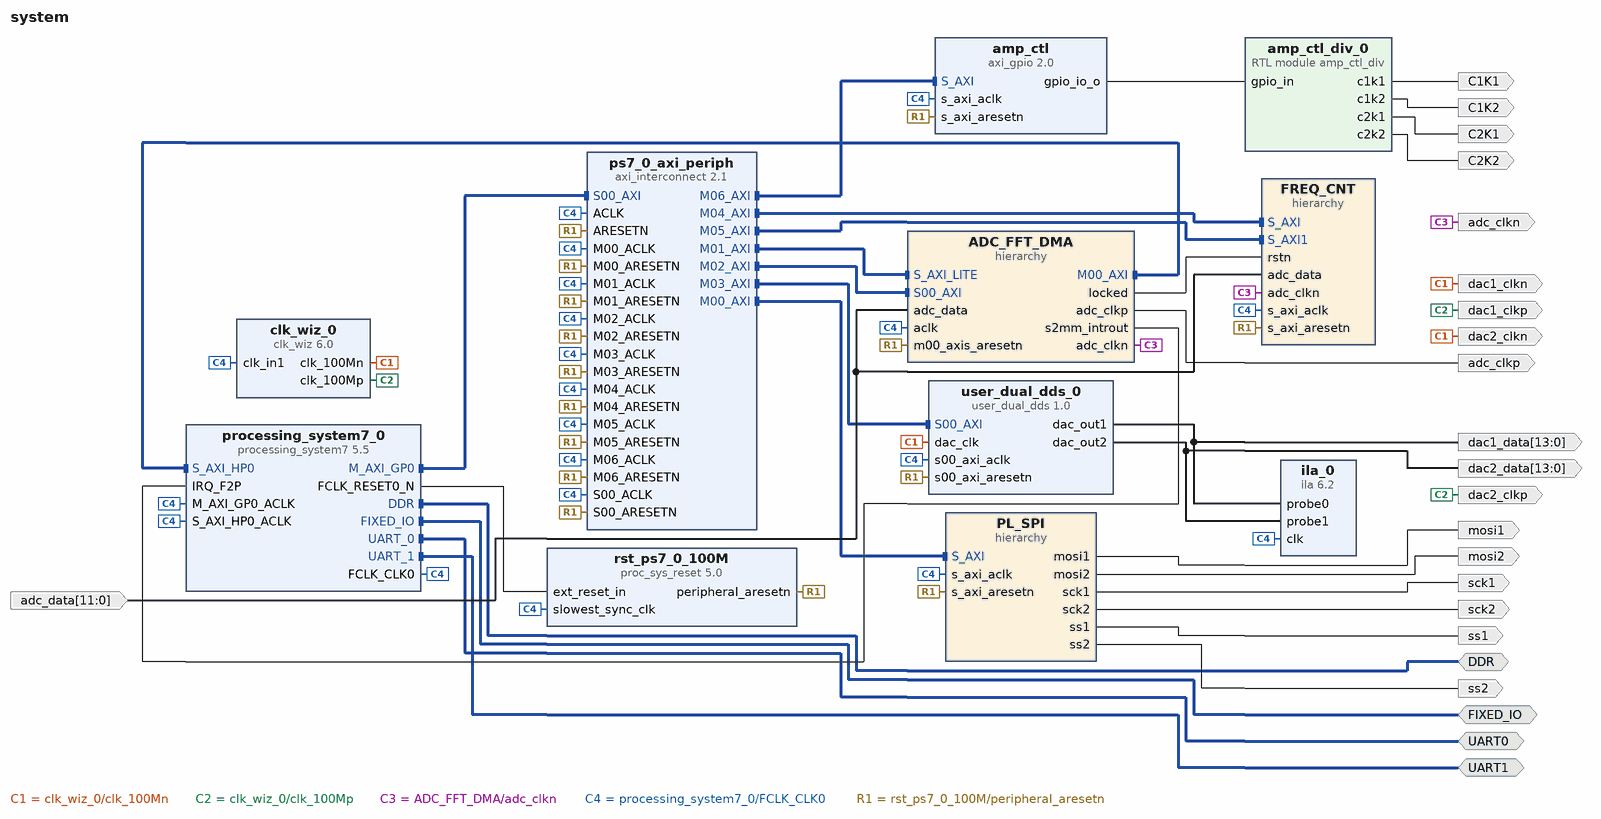
[diagram p0: block diagram of the top level]
# Vivado block design system, xc7z020clg400-2, Vivado 2023.2
create_bd_design system

create_bd_intf_port -mode Master -vlnv xilinx.com:interface:uart_rtl:1.0 UART0
create_bd_intf_port -mode Master -vlnv xilinx.com:interface:uart_rtl:1.0 UART1
create_bd_intf_port -mode Master -vlnv xilinx.com:interface:ddrx_rtl:1.0 DDR
create_bd_intf_port -mode Master -vlnv xilinx.com:display_processing_system7:fixedio_rtl:1.0 FIXED_IO
create_bd_port -dir O sck1
create_bd_port -dir O sck2
create_bd_port -dir O mosi1
create_bd_port -dir O mosi2
create_bd_port -dir O ss1
create_bd_port -dir O ss2
create_bd_port -dir O -type clk adc_clkp
create_bd_port -dir O -type clk adc_clkn
create_bd_port -dir I -from 11 -to 0 adc_data
create_bd_port -dir O -from 13 -to 0 dac1_data
create_bd_port -dir O -from 13 -to 0 dac2_data
create_bd_port -dir O -type clk dac1_clkp
create_bd_port -dir O -type clk dac1_clkn
create_bd_port -dir O -type clk dac2_clkp
create_bd_port -dir O -type clk dac2_clkn
create_bd_port -dir O C1K1
create_bd_port -dir O C1K2
create_bd_port -dir O C2K1
create_bd_port -dir O C2K2

create_bd_cell -type ip -vlnv xilinx.com:ip:processing_system7:5.5 processing_system7_0
set_property -dict [list \
  CONFIG.PCW_APU_PERIPHERAL_FREQMHZ 666.666666 \
  CONFIG.PCW_CPU_CPU_6X4X_MAX_RANGE 767 \
  CONFIG.PCW_ENET0_PERIPHERAL_ENABLE 0 \
  CONFIG.PCW_FCLK_CLK0_BUF FALSE \
  CONFIG.PCW_FPGA0_PERIPHERAL_FREQMHZ 100 \
  CONFIG.PCW_FPGA1_PERIPHERAL_FREQMHZ 50 \
  CONFIG.PCW_GPIO_MIO_GPIO_ENABLE 0 \
  CONFIG.PCW_IRQ_F2P_INTR 1 \
  CONFIG.PCW_PERIPHERAL_BOARD_PRESET None \
  CONFIG.PCW_PRESET_BANK1_VOLTAGE {LVCMOS 1.8V} \
  CONFIG.PCW_QSPI_GRP_FBCLK_ENABLE 1 \
  CONFIG.PCW_QSPI_GRP_FBCLK_IO {MIO 8} \
  CONFIG.PCW_QSPI_GRP_SINGLE_SS_ENABLE 1 \
  CONFIG.PCW_QSPI_GRP_SINGLE_SS_IO {MIO 1 .. 6} \
  CONFIG.PCW_QSPI_PERIPHERAL_ENABLE 1 \
  CONFIG.PCW_QSPI_PERIPHERAL_FREQMHZ 125 \
  CONFIG.PCW_QSPI_QSPI_IO {MIO 1 .. 6} \
  CONFIG.PCW_SD0_GRP_CD_ENABLE 1 \
  CONFIG.PCW_SD0_GRP_CD_IO {MIO 47} \
  CONFIG.PCW_SD0_GRP_WP_ENABLE 0 \
  CONFIG.PCW_SD0_PERIPHERAL_ENABLE 1 \
  CONFIG.PCW_SD0_SD0_IO {MIO 40 .. 45} \
  CONFIG.PCW_SD1_GRP_CD_ENABLE 1 \
  CONFIG.PCW_SD1_GRP_CD_IO {MIO 9} \
  CONFIG.PCW_SD1_GRP_WP_ENABLE 1 \
  CONFIG.PCW_SD1_GRP_WP_IO {MIO 0} \
  CONFIG.PCW_SD1_PERIPHERAL_ENABLE 1 \
  CONFIG.PCW_SD1_SD1_IO {MIO 10 .. 15} \
  CONFIG.PCW_SDIO_PERIPHERAL_FREQMHZ 100 \
  CONFIG.PCW_SINGLE_QSPI_DATA_MODE x4 \
  CONFIG.PCW_UART0_PERIPHERAL_ENABLE 1 \
  CONFIG.PCW_UART0_UART0_IO EMIO \
  CONFIG.PCW_UART1_PERIPHERAL_ENABLE 1 \
  CONFIG.PCW_UART1_UART1_IO EMIO \
  CONFIG.PCW_UART_PERIPHERAL_FREQMHZ 100 \
  CONFIG.PCW_UIPARAM_DDR_FREQ_MHZ 533.333333 \
  CONFIG.PCW_UIPARAM_DDR_PARTNO {MT41K256M16 RE-125} \
  CONFIG.PCW_USB0_PERIPHERAL_ENABLE 0 \
  CONFIG.PCW_USE_FABRIC_INTERRUPT 1 \
  CONFIG.PCW_USE_S_AXI_HP0 1 \
] [get_bd_cells processing_system7_0]
# 412 more settings of processing_system7_0 are not shown: defaults, MIO pin electricals, DDR timing, and values the tool derives
create_bd_cell -type ip -vlnv xilinx.com:ip:axi_interconnect:2.1 ps7_0_axi_periph
set_property -dict {CONFIG.NUM_MI 7} [get_bd_cells ps7_0_axi_periph]
create_bd_cell -type ip -vlnv xilinx.com:ip:proc_sys_reset:5.0 rst_ps7_0_100M
create_bd_cell -type hier ADC_FFT_DMA
create_bd_cell -type ip -vlnv xilinx.com:ip:clk_wiz:6.0 clk_wiz_0
set_property -dict [list \
  CONFIG.CLKOUT2_JITTER 130.958 \
  CONFIG.CLKOUT2_PHASE_ERROR 98.575 \
  CONFIG.CLKOUT2_REQUESTED_PHASE 180 \
  CONFIG.CLKOUT2_USED true \
  CONFIG.CLK_OUT1_PORT clk_100Mp \
  CONFIG.CLK_OUT2_PORT clk_100Mn \
  CONFIG.MMCM_CLKOUT1_DIVIDE 10 \
  CONFIG.MMCM_CLKOUT1_PHASE 180.000 \
  CONFIG.NUM_OUT_CLKS 2 \
  CONFIG.PRIM_IN_FREQ 100.000 \
  CONFIG.USE_LOCKED false \
  CONFIG.USE_RESET false \
] [get_bd_cells clk_wiz_0]
create_bd_cell -type hier PL_SPI
create_bd_cell -type ip -vlnv xilinx.com:user:user_dual_dds:1.0 user_dual_dds_0
create_bd_cell -type ip -vlnv xilinx.com:ip:ila:6.2 ila_0
set_property -dict [list \
  CONFIG.ALL_PROBE_SAME_MU false \
  CONFIG.C_DATA_DEPTH 4096 \
  CONFIG.C_EN_STRG_QUAL 1 \
  CONFIG.C_MONITOR_TYPE Native \
  CONFIG.C_NUM_OF_PROBES 2 \
  CONFIG.C_PROBE0_WIDTH 14 \
  CONFIG.C_PROBE1_WIDTH 14 \
] [get_bd_cells ila_0]
create_bd_cell -type hier FREQ_CNT
create_bd_cell -type module -reference amp_ctl_div amp_ctl_div_0
create_bd_cell -type ip -vlnv xilinx.com:ip:axi_gpio:2.0 amp_ctl
set_property -dict {CONFIG.C_ALL_OUTPUTS 1 CONFIG.C_GPIO_WIDTH 4} [get_bd_cells amp_ctl]

# ---- hierarchy /ADC_FFT_DMA ----
current_bd_instance /ADC_FFT_DMA
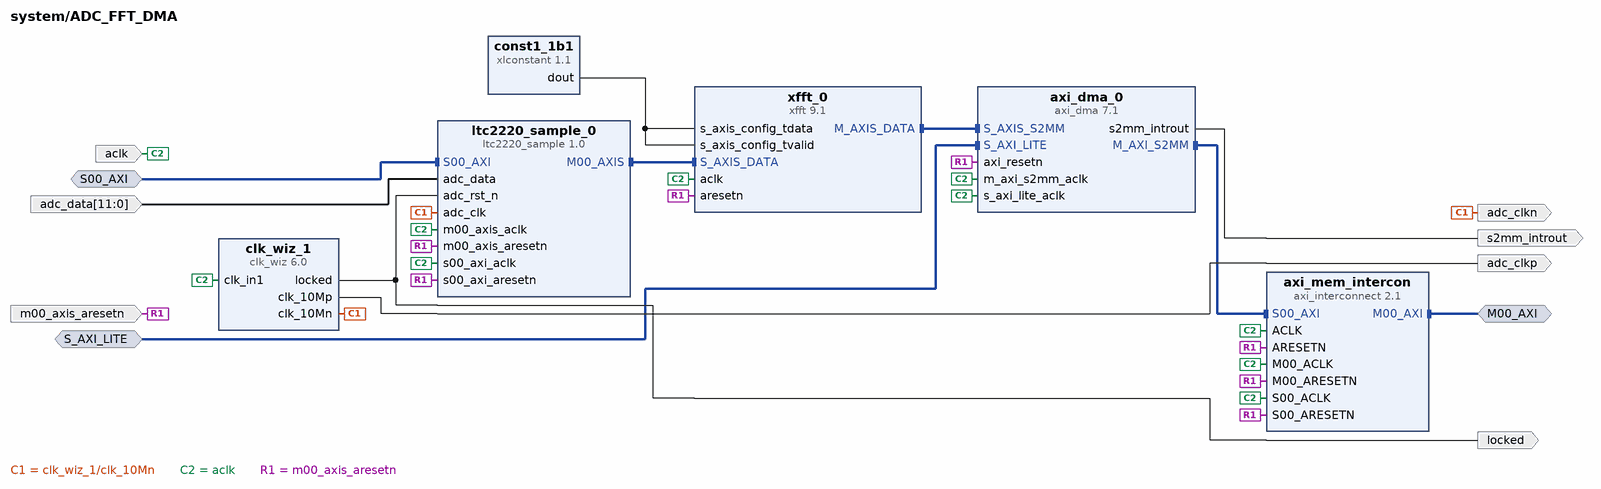
[diagram p1: block diagram inside /ADC_FFT_DMA]
create_bd_intf_pin -mode Slave -vlnv xilinx.com:interface:aximm_rtl:1.0 S_AXI_LITE
create_bd_intf_pin -mode Slave -vlnv xilinx.com:interface:aximm_rtl:1.0 S00_AXI
create_bd_intf_pin -mode Master -vlnv xilinx.com:interface:aximm_rtl:1.0 M00_AXI
create_bd_pin -dir I -type clk aclk
create_bd_pin -dir I -type rst m00_axis_aresetn
create_bd_pin -dir O -type intr s2mm_introut
create_bd_pin -dir I -from 11 -to 0 adc_data
create_bd_pin -dir O -type clk adc_clkp
create_bd_pin -dir O -type clk adc_clkn
create_bd_pin -dir O locked

create_bd_cell -type ip -vlnv xilinx.com:ip:xlconstant:1.1 const1_1b1
create_bd_cell -type ip -vlnv xilinx.com:ip:axi_dma:7.1 axi_dma_0
set_property -dict [list \
  CONFIG.c_include_mm2s 0 \
  CONFIG.c_include_sg 0 \
  CONFIG.c_m_axi_s2mm_data_width 64 \
  CONFIG.c_s_axis_s2mm_tdata_width 64 \
  CONFIG.c_sg_length_width 18 \
] [get_bd_cells axi_dma_0]
create_bd_cell -type ip -vlnv xilinx.com:ip:xfft:9.1 xfft_0
set_property -dict [list \
  CONFIG.aresetn true \
  CONFIG.data_format fixed_point \
  CONFIG.implementation_options radix_2_burst_io \
  CONFIG.input_width 16 \
  CONFIG.number_of_stages_using_block_ram_for_data_and_phase_factors 0 \
  CONFIG.output_ordering natural_order \
  CONFIG.scaling_options unscaled \
  CONFIG.target_clock_frequency 100 \
  CONFIG.transform_length 8192 \
] [get_bd_cells xfft_0]
create_bd_cell -type ip -vlnv xilinx.com:user:ltc2220_sample:1.0 ltc2220_sample_0
create_bd_cell -type ip -vlnv xilinx.com:ip:axi_interconnect:2.1 axi_mem_intercon
set_property -dict {CONFIG.NUM_MI 1} [get_bd_cells axi_mem_intercon]
create_bd_cell -type ip -vlnv xilinx.com:ip:clk_wiz:6.0 clk_wiz_1
set_property -dict [list \
  CONFIG.CLKOUT1_JITTER 209.588 \
  CONFIG.CLKOUT1_REQUESTED_OUT_FREQ 10 \
  CONFIG.CLKOUT2_JITTER 209.588 \
  CONFIG.CLKOUT2_PHASE_ERROR 98.575 \
  CONFIG.CLKOUT2_USED true \
  CONFIG.CLK_OUT1_PORT clk_10Mp \
  CONFIG.MMCM_CLKOUT0_DIVIDE_F 100.000 \
  CONFIG.MMCM_CLKOUT1_DIVIDE 100 \
  CONFIG.NUM_OUT_CLKS 2 \
  CONFIG.USE_RESET false \
] [get_bd_cells clk_wiz_1]

# ---- hierarchy /PL_SPI ----
current_bd_instance /PL_SPI
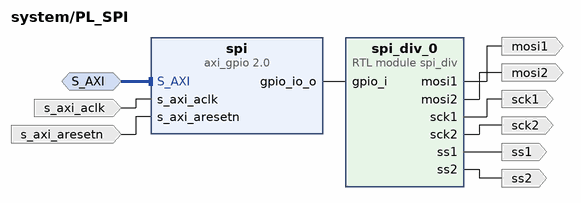
[diagram p2: block diagram inside /PL_SPI]
create_bd_intf_pin -mode Slave -vlnv xilinx.com:interface:aximm_rtl:1.0 S_AXI
create_bd_pin -dir O sck1
create_bd_pin -dir O sck2
create_bd_pin -dir O mosi1
create_bd_pin -dir O mosi2
create_bd_pin -dir O ss1
create_bd_pin -dir O ss2
create_bd_pin -dir I -type clk s_axi_aclk
create_bd_pin -dir I -type rst s_axi_aresetn

create_bd_cell -type module -reference spi_div spi_div_0
create_bd_cell -type ip -vlnv xilinx.com:ip:axi_gpio:2.0 spi
set_property -dict {CONFIG.C_ALL_OUTPUTS 1 CONFIG.C_GPIO_WIDTH 4} [get_bd_cells spi]

# ---- hierarchy /FREQ_CNT ----
current_bd_instance /FREQ_CNT
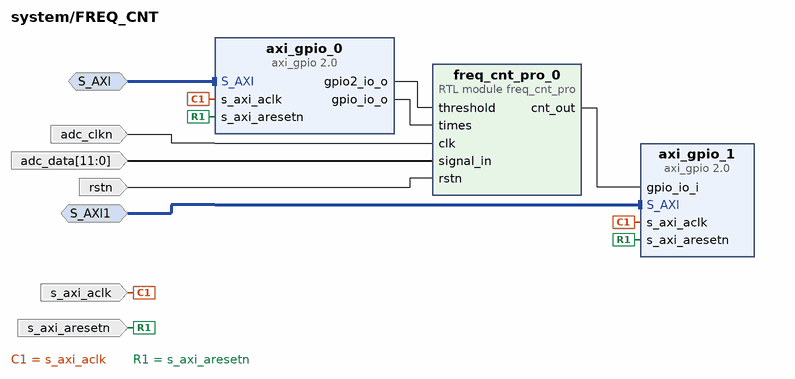
[diagram p3: block diagram inside /FREQ_CNT]
create_bd_intf_pin -mode Slave -vlnv xilinx.com:interface:aximm_rtl:1.0 S_AXI
create_bd_intf_pin -mode Slave -vlnv xilinx.com:interface:aximm_rtl:1.0 S_AXI1
create_bd_pin -dir I -type clk adc_clkn
create_bd_pin -dir I -type rst rstn
create_bd_pin -dir I -from 11 -to 0 adc_data
create_bd_pin -dir I -type clk s_axi_aclk
create_bd_pin -dir I -type rst s_axi_aresetn

create_bd_cell -type ip -vlnv xilinx.com:ip:axi_gpio:2.0 axi_gpio_0
set_property -dict [list \
  CONFIG.C_ALL_INPUTS 0 \
  CONFIG.C_ALL_INPUTS_2 0 \
  CONFIG.C_ALL_OUTPUTS 1 \
  CONFIG.C_ALL_OUTPUTS_2 1 \
  CONFIG.C_GPIO2_WIDTH 12 \
  CONFIG.C_IS_DUAL 1 \
] [get_bd_cells axi_gpio_0]
create_bd_cell -type module -reference freq_cnt_pro freq_cnt_pro_0
set_property -dict {CONFIG.WD 12} [get_bd_cells freq_cnt_pro_0]
create_bd_cell -type ip -vlnv xilinx.com:ip:axi_gpio:2.0 axi_gpio_1
set_property -dict {CONFIG.C_ALL_INPUTS 1 CONFIG.C_IS_DUAL 0} [get_bd_cells axi_gpio_1]

# ---- connections ----

current_bd_instance /ADC_FFT_DMA
connect_bd_intf_net [get_bd_intf_pins axi_dma_0/M_AXI_S2MM] [get_bd_intf_pins axi_mem_intercon/S00_AXI]
connect_bd_intf_net [get_bd_intf_pins M00_AXI] [get_bd_intf_pins axi_mem_intercon/M00_AXI]
connect_bd_intf_net [get_bd_intf_pins ltc2220_sample_0/M00_AXIS] [get_bd_intf_pins xfft_0/S_AXIS_DATA]
connect_bd_intf_net [get_bd_intf_pins S_AXI_LITE] [get_bd_intf_pins axi_dma_0/S_AXI_LITE]
connect_bd_intf_net [get_bd_intf_pins S00_AXI] [get_bd_intf_pins ltc2220_sample_0/S00_AXI]
connect_bd_intf_net [get_bd_intf_pins xfft_0/M_AXIS_DATA] [get_bd_intf_pins axi_dma_0/S_AXIS_S2MM]
connect_bd_net [get_bd_pins adc_data] [get_bd_pins ltc2220_sample_0/adc_data]
connect_bd_net [get_bd_pins axi_dma_0/s2mm_introut] [get_bd_pins s2mm_introut]
connect_bd_net [get_bd_pins clk_wiz_1/clk_10Mn] [get_bd_pins adc_clkn] [get_bd_pins ltc2220_sample_0/adc_clk]
connect_bd_net [get_bd_pins clk_wiz_1/clk_10Mp] [get_bd_pins adc_clkp]
connect_bd_net [get_bd_pins clk_wiz_1/locked] [get_bd_pins locked] [get_bd_pins ltc2220_sample_0/adc_rst_n]
connect_bd_net -net const_1b1_dout [get_bd_pins const1_1b1/dout] [get_bd_pins xfft_0/s_axis_config_tdata] [get_bd_pins xfft_0/s_axis_config_tvalid]
connect_bd_net -net processing_system7_0_FCLK_CLK0 [get_bd_pins aclk] \
  [get_bd_pins xfft_0/aclk] [get_bd_pins axi_dma_0/m_axi_s2mm_aclk] [get_bd_pins axi_mem_intercon/S00_ACLK] \
  [get_bd_pins axi_mem_intercon/M00_ACLK] [get_bd_pins axi_mem_intercon/ACLK] [get_bd_pins axi_dma_0/s_axi_lite_aclk] \
  [get_bd_pins clk_wiz_1/clk_in1] [get_bd_pins ltc2220_sample_0/m00_axis_aclk] [get_bd_pins ltc2220_sample_0/s00_axi_aclk]
connect_bd_net -net rst_ps7_0_100M_peripheral_aresetn [get_bd_pins m00_axis_aresetn] \
  [get_bd_pins axi_mem_intercon/S00_ARESETN] [get_bd_pins axi_mem_intercon/M00_ARESETN] \
  [get_bd_pins axi_mem_intercon/ARESETN] [get_bd_pins axi_dma_0/axi_resetn] [get_bd_pins xfft_0/aresetn] \
  [get_bd_pins ltc2220_sample_0/m00_axis_aresetn] [get_bd_pins ltc2220_sample_0/s00_axi_aresetn]

current_bd_instance /PL_SPI
connect_bd_intf_net [get_bd_intf_pins S_AXI] [get_bd_intf_pins spi/S_AXI]
connect_bd_net -net processing_system7_0_FCLK_CLK0 [get_bd_pins s_axi_aclk] [get_bd_pins spi/s_axi_aclk]
connect_bd_net -net rst_ps7_0_100M_peripheral_aresetn [get_bd_pins s_axi_aresetn] [get_bd_pins spi/s_axi_aresetn]
connect_bd_net [get_bd_pins spi_div_0/mosi1] [get_bd_pins mosi1]
connect_bd_net [get_bd_pins spi_div_0/mosi2] [get_bd_pins mosi2]
connect_bd_net [get_bd_pins spi_div_0/sck1] [get_bd_pins sck1]
connect_bd_net [get_bd_pins spi_div_0/sck2] [get_bd_pins sck2]
connect_bd_net [get_bd_pins spi_div_0/ss1] [get_bd_pins ss1]
connect_bd_net [get_bd_pins spi_div_0/ss2] [get_bd_pins ss2]
connect_bd_net [get_bd_pins spi/gpio_io_o] [get_bd_pins spi_div_0/gpio_i]

current_bd_instance /FREQ_CNT
connect_bd_intf_net [get_bd_intf_pins axi_gpio_1/S_AXI] [get_bd_intf_pins S_AXI1]
connect_bd_intf_net [get_bd_intf_pins S_AXI] [get_bd_intf_pins axi_gpio_0/S_AXI]
connect_bd_net [get_bd_pins adc_clkn] [get_bd_pins freq_cnt_pro_0/clk]
connect_bd_net [get_bd_pins adc_data] [get_bd_pins freq_cnt_pro_0/signal_in]
connect_bd_net [get_bd_pins axi_gpio_0/gpio2_io_o] [get_bd_pins freq_cnt_pro_0/threshold]
connect_bd_net [get_bd_pins axi_gpio_0/gpio_io_o] [get_bd_pins freq_cnt_pro_0/times]
connect_bd_net [get_bd_pins freq_cnt_pro_0/cnt_out] [get_bd_pins axi_gpio_1/gpio_io_i]
connect_bd_net -net processing_system7_0_FCLK_CLK0 [get_bd_pins s_axi_aclk] [get_bd_pins axi_gpio_0/s_axi_aclk] [get_bd_pins axi_gpio_1/s_axi_aclk]
connect_bd_net -net rst_ps7_0_100M_peripheral_aresetn [get_bd_pins s_axi_aresetn] \
  [get_bd_pins axi_gpio_0/s_axi_aresetn] [get_bd_pins axi_gpio_1/s_axi_aresetn]
connect_bd_net [get_bd_pins rstn] [get_bd_pins freq_cnt_pro_0/rstn]

current_bd_instance /
connect_bd_intf_net -intf_net axi_mem_intercon_M00_AXI [get_bd_intf_pins ADC_FFT_DMA/M00_AXI] [get_bd_intf_pins processing_system7_0/S_AXI_HP0]
connect_bd_intf_net [get_bd_intf_ports DDR] [get_bd_intf_pins processing_system7_0/DDR]
connect_bd_intf_net [get_bd_intf_ports FIXED_IO] [get_bd_intf_pins processing_system7_0/FIXED_IO]
connect_bd_intf_net [get_bd_intf_pins processing_system7_0/M_AXI_GP0] [get_bd_intf_pins ps7_0_axi_periph/S00_AXI]
connect_bd_intf_net [get_bd_intf_ports UART0] [get_bd_intf_pins processing_system7_0/UART_0]
connect_bd_intf_net [get_bd_intf_ports UART1] [get_bd_intf_pins processing_system7_0/UART_1]
connect_bd_intf_net [get_bd_intf_pins ps7_0_axi_periph/M00_AXI] [get_bd_intf_pins PL_SPI/S_AXI]
connect_bd_intf_net [get_bd_intf_pins ps7_0_axi_periph/M01_AXI] [get_bd_intf_pins ADC_FFT_DMA/S_AXI_LITE]
connect_bd_intf_net [get_bd_intf_pins ps7_0_axi_periph/M02_AXI] [get_bd_intf_pins ADC_FFT_DMA/S00_AXI]
connect_bd_intf_net [get_bd_intf_pins ps7_0_axi_periph/M03_AXI] [get_bd_intf_pins user_dual_dds_0/S00_AXI]
connect_bd_intf_net [get_bd_intf_pins ps7_0_axi_periph/M04_AXI] [get_bd_intf_pins FREQ_CNT/S_AXI]
connect_bd_intf_net [get_bd_intf_pins ps7_0_axi_periph/M05_AXI] [get_bd_intf_pins FREQ_CNT/S_AXI1]
connect_bd_intf_net [get_bd_intf_pins ps7_0_axi_periph/M06_AXI] [get_bd_intf_pins amp_ctl/S_AXI]
connect_bd_net [get_bd_pins ADC_FFT_DMA/adc_clkp] [get_bd_ports adc_clkp]
connect_bd_net [get_bd_pins ADC_FFT_DMA/locked] [get_bd_pins FREQ_CNT/rstn]
connect_bd_net [get_bd_ports adc_data] [get_bd_pins ADC_FFT_DMA/adc_data] [get_bd_pins FREQ_CNT/adc_data]
connect_bd_net [get_bd_pins amp_ctl_div_0/c1k1] [get_bd_ports C1K1]
connect_bd_net [get_bd_pins amp_ctl_div_0/c1k2] [get_bd_ports C1K2]
connect_bd_net [get_bd_pins amp_ctl_div_0/c2k1] [get_bd_ports C2K1]
connect_bd_net [get_bd_pins amp_ctl_div_0/c2k2] [get_bd_ports C2K2]
connect_bd_net -net axi_dma_0_s2mm_introut [get_bd_pins ADC_FFT_DMA/s2mm_introut] [get_bd_pins processing_system7_0/IRQ_F2P]
connect_bd_net -net axi_gpio_0_gpio_io_o [get_bd_pins amp_ctl/gpio_io_o] [get_bd_pins amp_ctl_div_0/gpio_in]
connect_bd_net [get_bd_pins clk_wiz_0/clk_100Mn] [get_bd_ports dac2_clkn] [get_bd_ports dac1_clkn] [get_bd_pins user_dual_dds_0/dac_clk]
connect_bd_net [get_bd_pins clk_wiz_0/clk_100Mp] [get_bd_ports dac1_clkp] [get_bd_ports dac2_clkp]
connect_bd_net -net clk_wiz_1_clk_10Mn [get_bd_pins ADC_FFT_DMA/adc_clkn] [get_bd_ports adc_clkn] [get_bd_pins FREQ_CNT/adc_clkn]
connect_bd_net [get_bd_pins processing_system7_0/FCLK_CLK0] \
  [get_bd_pins processing_system7_0/M_AXI_GP0_ACLK] [get_bd_pins ps7_0_axi_periph/S00_ACLK] \
  [get_bd_pins rst_ps7_0_100M/slowest_sync_clk] [get_bd_pins ps7_0_axi_periph/M00_ACLK] [get_bd_pins ps7_0_axi_periph/ACLK] \
  [get_bd_pins ps7_0_axi_periph/M01_ACLK] [get_bd_pins ps7_0_axi_periph/M02_ACLK] \
  [get_bd_pins processing_system7_0/S_AXI_HP0_ACLK] [get_bd_pins ADC_FFT_DMA/aclk] [get_bd_pins clk_wiz_0/clk_in1] \
  [get_bd_pins PL_SPI/s_axi_aclk] [get_bd_pins ps7_0_axi_periph/M03_ACLK] [get_bd_pins ila_0/clk] \
  [get_bd_pins ps7_0_axi_periph/M04_ACLK] [get_bd_pins FREQ_CNT/s_axi_aclk] [get_bd_pins ps7_0_axi_periph/M05_ACLK] \
  [get_bd_pins amp_ctl/s_axi_aclk] [get_bd_pins ps7_0_axi_periph/M06_ACLK] [get_bd_pins user_dual_dds_0/s00_axi_aclk]
connect_bd_net [get_bd_pins processing_system7_0/FCLK_RESET0_N] [get_bd_pins rst_ps7_0_100M/ext_reset_in]
connect_bd_net [get_bd_pins rst_ps7_0_100M/peripheral_aresetn] \
  [get_bd_pins ps7_0_axi_periph/S00_ARESETN] [get_bd_pins ps7_0_axi_periph/M00_ARESETN] \
  [get_bd_pins ps7_0_axi_periph/ARESETN] [get_bd_pins ps7_0_axi_periph/M01_ARESETN] \
  [get_bd_pins ps7_0_axi_periph/M02_ARESETN] [get_bd_pins ADC_FFT_DMA/m00_axis_aresetn] [get_bd_pins PL_SPI/s_axi_aresetn] \
  [get_bd_pins ps7_0_axi_periph/M03_ARESETN] [get_bd_pins ps7_0_axi_periph/M04_ARESETN] [get_bd_pins FREQ_CNT/s_axi_aresetn] \
  [get_bd_pins ps7_0_axi_periph/M05_ARESETN] [get_bd_pins amp_ctl/s_axi_aresetn] [get_bd_pins ps7_0_axi_periph/M06_ARESETN] \
  [get_bd_pins user_dual_dds_0/s00_axi_aresetn]
connect_bd_net -net spi_div_0_mosi1 [get_bd_pins PL_SPI/mosi1] [get_bd_ports mosi1]
connect_bd_net -net spi_div_0_mosi2 [get_bd_pins PL_SPI/mosi2] [get_bd_ports mosi2]
connect_bd_net -net spi_div_0_sck1 [get_bd_pins PL_SPI/sck1] [get_bd_ports sck1]
connect_bd_net -net spi_div_0_sck2 [get_bd_pins PL_SPI/sck2] [get_bd_ports sck2]
connect_bd_net -net spi_div_0_ss1 [get_bd_pins PL_SPI/ss1] [get_bd_ports ss1]
connect_bd_net -net spi_div_0_ss2 [get_bd_pins PL_SPI/ss2] [get_bd_ports ss2]
connect_bd_net [get_bd_pins user_dual_dds_0/dac_out1] [get_bd_ports dac1_data] [get_bd_pins ila_0/probe0]
connect_bd_net [get_bd_pins user_dual_dds_0/dac_out2] [get_bd_ports dac2_data] [get_bd_pins ila_0/probe1]

# ---- address map ----
assign_bd_address -offset 0x00000000 -range 1G -target_address_space [get_bd_addr_spaces ADC_FFT_DMA/axi_dma_0/Data_S2MM] [get_bd_addr_segs processing_system7_0/S_AXI_HP0/HP0_DDR_LOWOCM]
assign_bd_address -offset 0x40400000 -range 64K -target_address_space [get_bd_addr_spaces processing_system7_0/Data] [get_bd_addr_segs ADC_FFT_DMA/axi_dma_0/S_AXI_LITE/Reg]
assign_bd_address -offset 0x41200000 -range 64K -target_address_space [get_bd_addr_spaces processing_system7_0/Data] [get_bd_addr_segs PL_SPI/spi/S_AXI/Reg]
assign_bd_address -offset 0x41210000 -range 64K -target_address_space [get_bd_addr_spaces processing_system7_0/Data] [get_bd_addr_segs FREQ_CNT/axi_gpio_0/S_AXI/Reg]
assign_bd_address -offset 0x41220000 -range 64K -target_address_space [get_bd_addr_spaces processing_system7_0/Data] [get_bd_addr_segs FREQ_CNT/axi_gpio_1/S_AXI/Reg]
assign_bd_address -offset 0x41230000 -range 64K -target_address_space [get_bd_addr_spaces processing_system7_0/Data] [get_bd_addr_segs amp_ctl/S_AXI/Reg]
assign_bd_address -offset 0x43C00000 -range 64K -target_address_space [get_bd_addr_spaces processing_system7_0/Data] [get_bd_addr_segs ADC_FFT_DMA/ltc2220_sample_0/S00_AXI/S00_AXI_reg]
assign_bd_address -offset 0x43C10000 -range 64K -target_address_space [get_bd_addr_spaces processing_system7_0/Data] [get_bd_addr_segs user_dual_dds_0/S00_AXI/S00_AXI_reg]

validate_bd_design
save_bd_design
